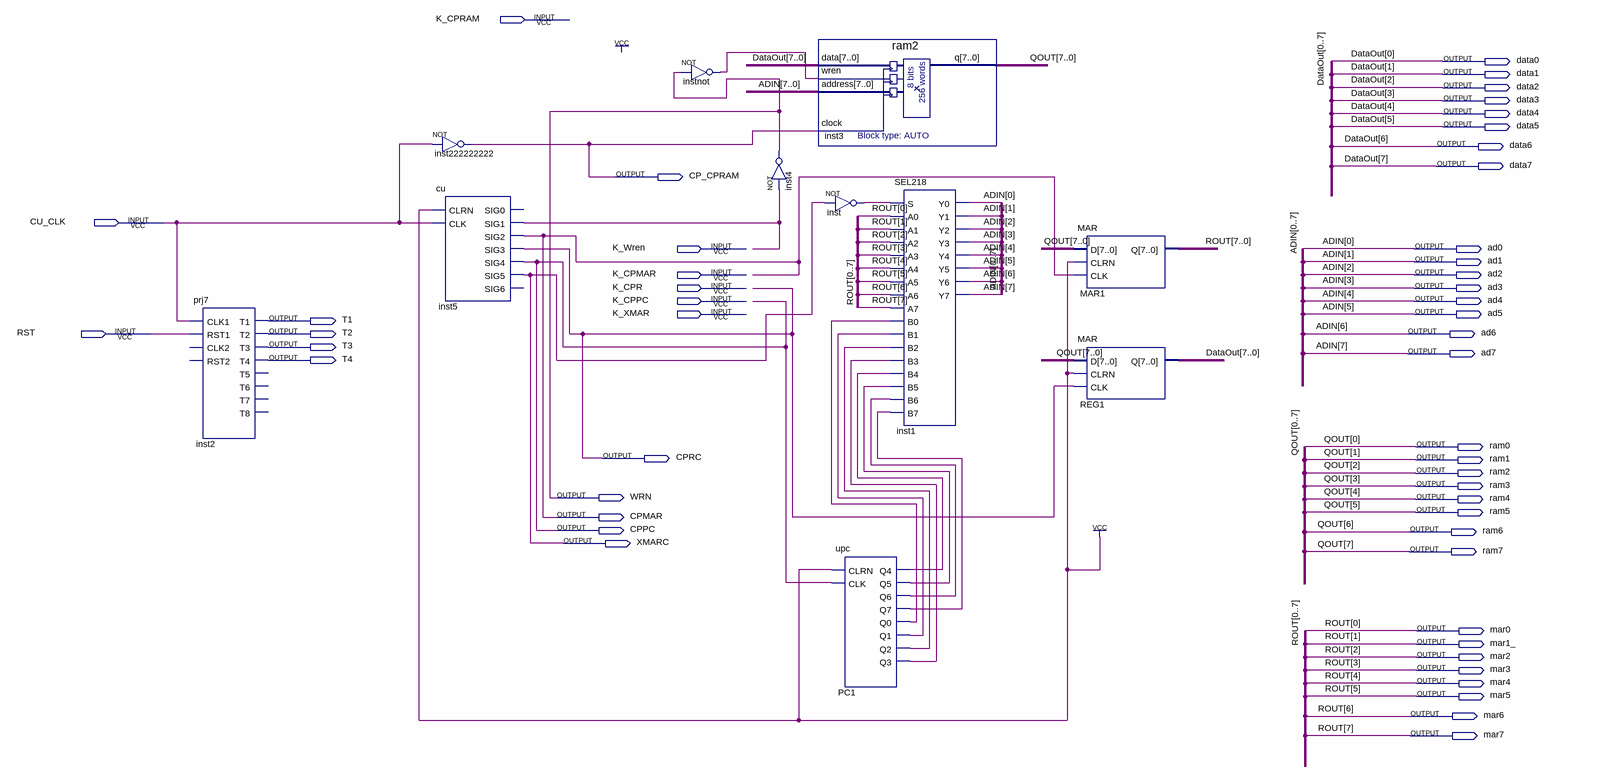
[diagram p0: schematic sheet]
// Quartus schematic prj2_real.bdf as structural Verilog: 11 symbols, 50 pins
module prj2_real (
  input  K_CPRAM,
  input  CU_CLK,
  input  K_Wren,
  input  K_CPMAR,
  input  K_CPR,
  input  K_CPPC,
  input  K_XMAR,
  input  RST,
  output data0,
  output data1,
  output data2,
  output data3,
  output data4,
  output data5,
  output data6,
  output data7,
  output CP_CPRAM,
  output ad0,
  output ad1,
  output ad2,
  output ad3,
  output ad4,
  output ad5,
  output T1,
  output T2,
  output ad6,
  output T3,
  output ad7,
  output T4,
  output ram0,
  output CPRC,
  output ram1,
  output ram2,
  output ram3,
  output WRN,
  output ram4,
  output ram5,
  output CPMAR,
  output CPPC,
  output ram6,
  output XMARC,
  output ram7,
  output mar0,
  output mar1_,
  output mar2,
  output mar3,
  output mar4,
  output mar5,
  output mar6,
  output mar7
);

  wire inst5_sig1, inst_out, instnot_out, PC1_q0, PC1_q1, PC1_q2, PC1_q3, PC1_q4, PC1_q5, PC1_q6, PC1_q7;

  prj7 inst2 (.CLK1(CU_CLK), .RST1(RST), .T1(T1), .T2(T2), .T3(T3), .T4(T4));  // open: CLK2, RST2, T5, T6, T7, T8
  not inst222222222 (CP_CPRAM, CU_CLK);
  cu inst5 (
    .CLRN(1'b1), .CLK(CU_CLK), .SIG1(inst5_sig1), .SIG2(CPMAR), .SIG3(CPRC), .SIG4(CPPC), .SIG5(XMARC));  // open: SIG0, SIG6
  not instnot (instnot_out, WRN);
  not inst4 (WRN, inst5_sig1);
  ram2 inst3 (
    .data({data7, data6, data5, data4, data3, data2, data1, data0}), .wren(instnot_out),
    .address({ad7, ad6, ad5, ad4, ad3, ad2, ad1, ad0}), .clock(CP_CPRAM),
    .q({ram7, ram6, ram5, ram4, ram3, ram2, ram1, ram0}));
  not inst (inst_out, XMARC);
  upc PC1 (
    .CLRN(1'b1), .CLK(CPPC), .Q4(PC1_q4), .Q5(PC1_q5), .Q6(PC1_q6), .Q7(PC1_q7), .Q0(PC1_q0), .Q1(PC1_q1),
    .Q2(PC1_q2), .Q3(PC1_q3));
  SEL218 inst1 (
    .S(inst_out), .A0(mar0), .A1(mar1_), .A2(mar2), .A3(mar3), .A4(mar4), .A5(mar5), .A6(mar6), .A7(mar7),
    .B0(PC1_q0), .B1(PC1_q1), .B2(PC1_q2), .B3(PC1_q3), .B4(PC1_q4), .B5(PC1_q5), .B6(PC1_q6), .B7(PC1_q7),
    .Y0(ad0), .Y1(ad1), .Y2(ad2), .Y3(ad3), .Y4(ad4), .Y5(ad5), .Y6(ad6), .Y7(ad7));
  MAR MAR1 (
    .D({ram7, ram6, ram5, ram4, ram3, ram2, ram1, ram0}), .CLRN(1'b1), .CLK(CPMAR),
    .Q({mar7, mar6, mar5, mar4, mar3, mar2, mar1_, mar0}));
  MAR REG1 (
    .D({ram7, ram6, ram5, ram4, ram3, ram2, ram1, ram0}), .CLRN(1'b1), .CLK(CPRC),
    .Q({data7, data6, data5, data4, data3, data2, data1, data0}));

  // Other names for the same wires on the sheet: ADIN[7:0] = {ad7, ad6, ad5, ad4, ad3, ad2, ad1, ad0};
  //   DataOut[7:0] = {data7, data6, data5, data4, data3, data2, data1, data0};
  //   QOUT[7:0] = {ram7, ram6, ram5, ram4, ram3, ram2, ram1, ram0};
  //   ROUT[7:0] = {mar7, mar6, mar5, mar4, mar3, mar2, mar1_, mar0}
endmodule
